# EAGLE design BaseStationV3 (EAGLE 5.07)
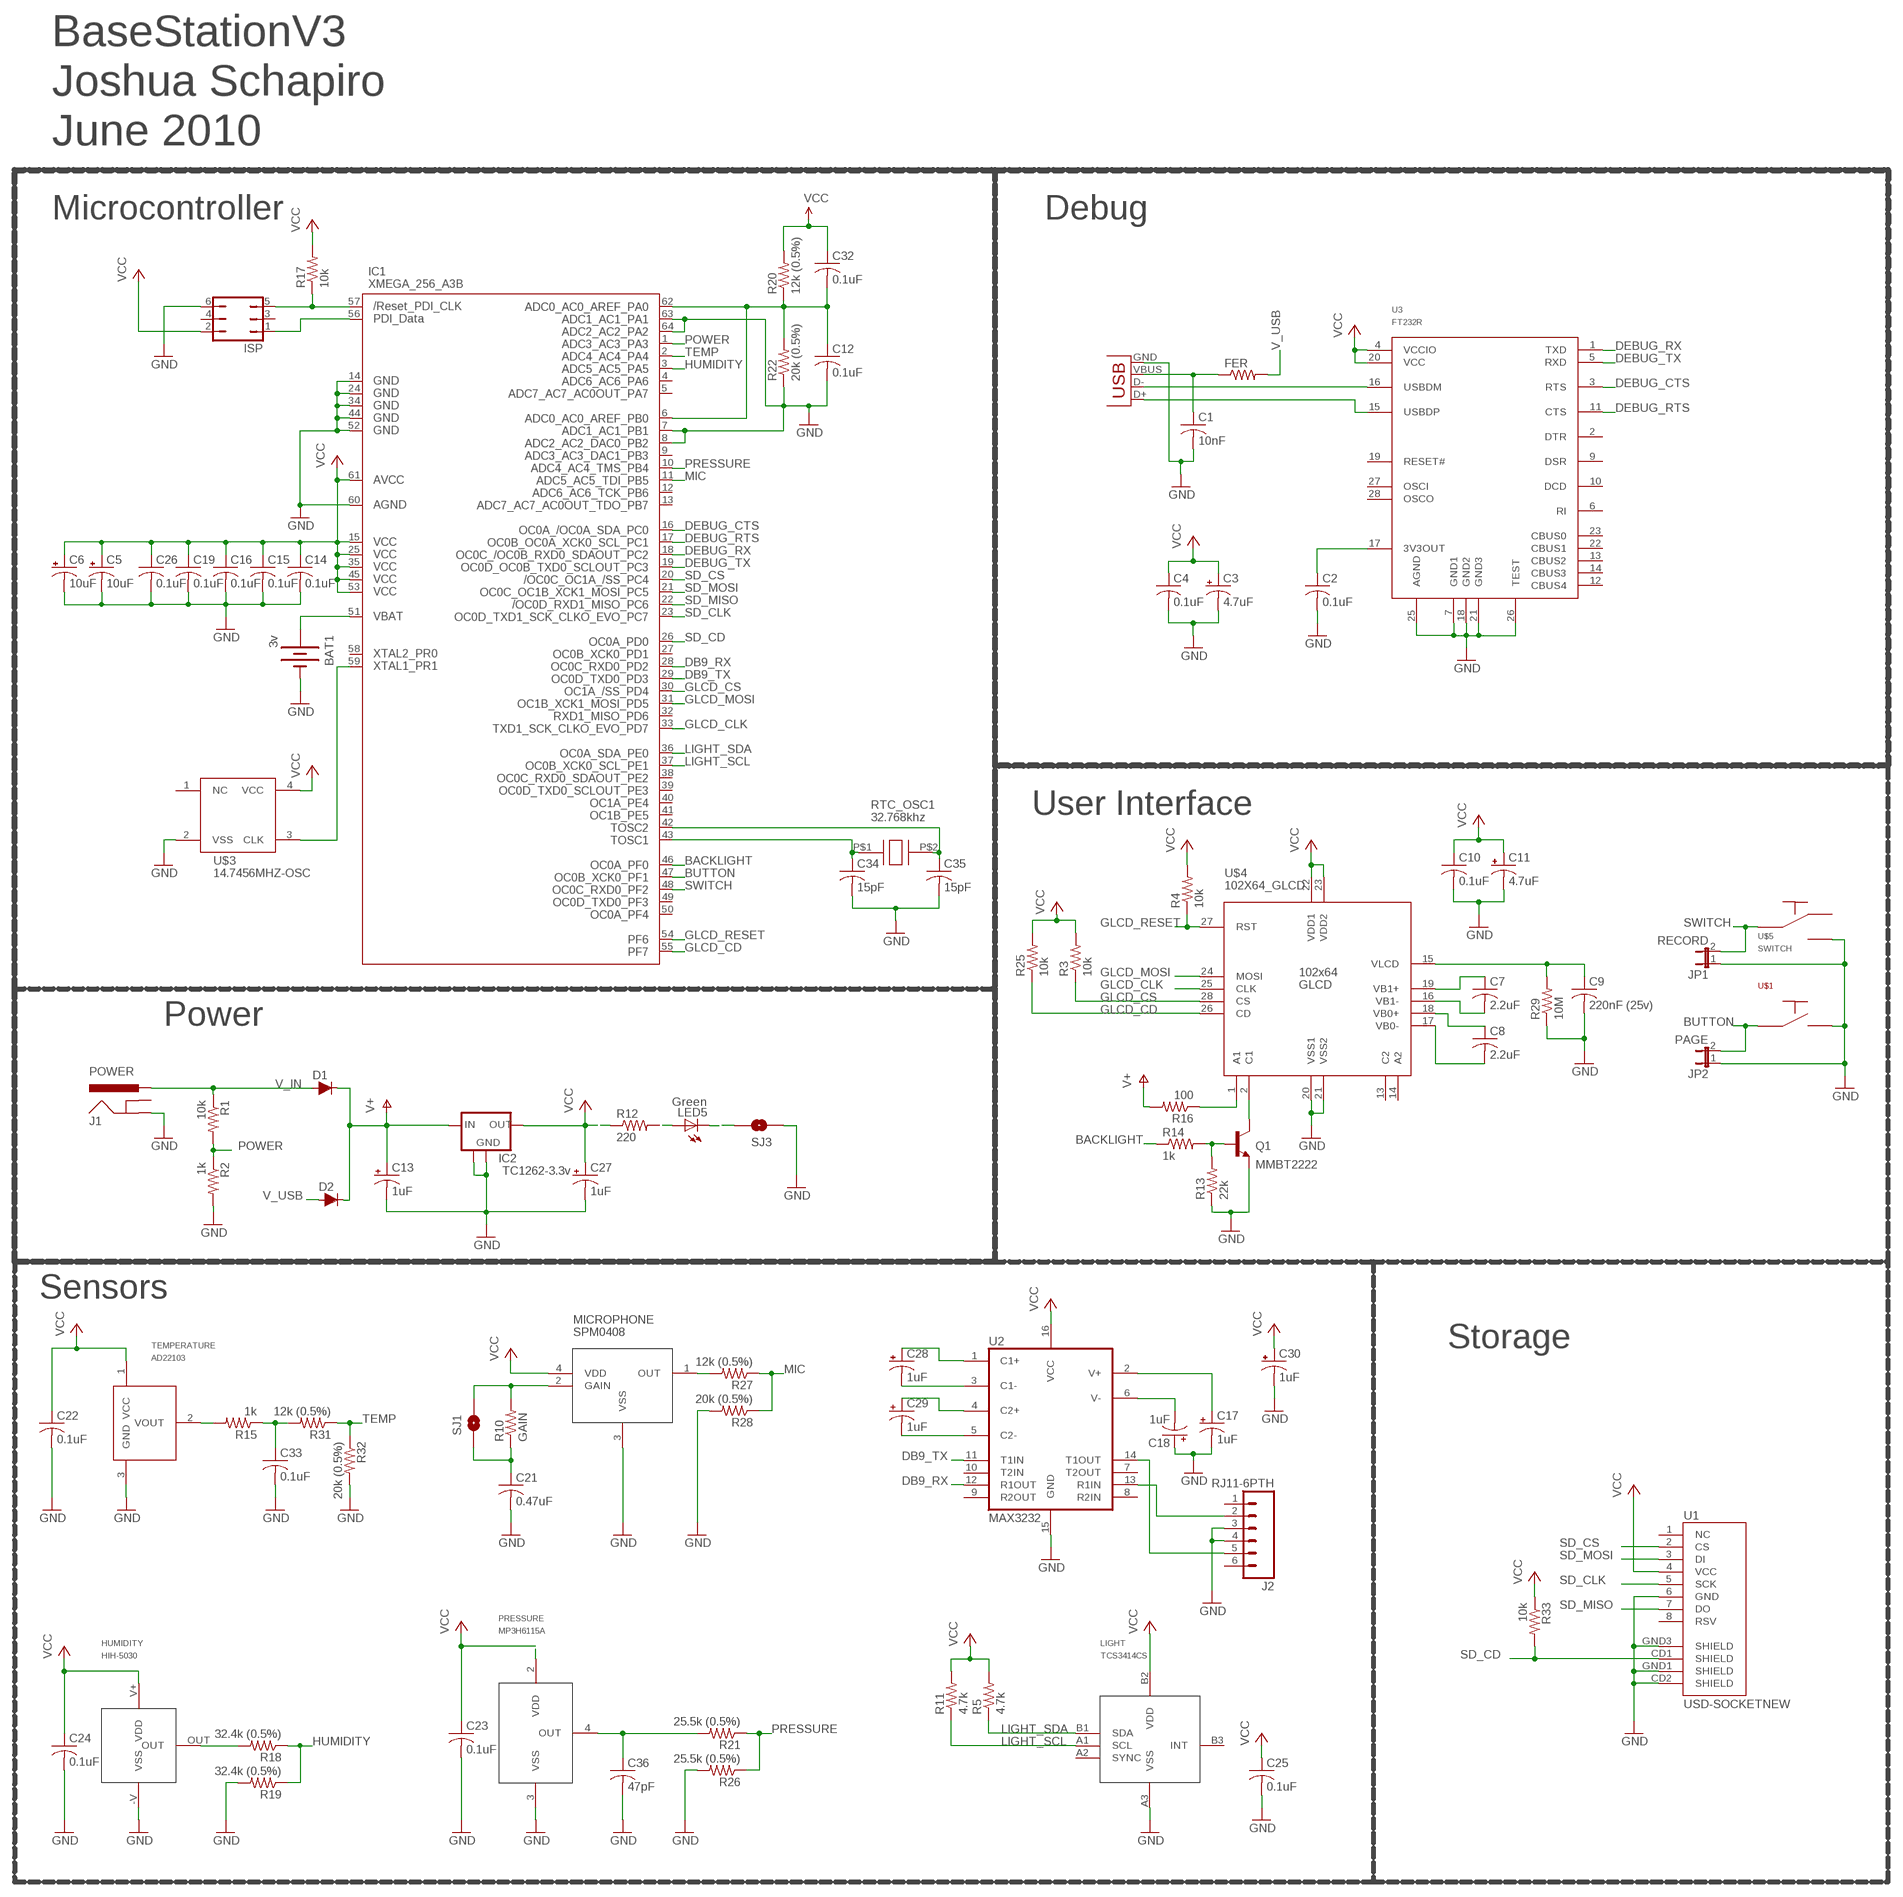
[diagram p0: schematic, sheet 1]

## Parts
BAT1  3v  BATTERY20PTH  [BATTCOM_20MM_PTH]
C1  10nF  C-USC1206  [C1206]
C2  0.1uF  C-USC1206  [C1206]
C3  4.7uF  CAP_POL1206  [EIA3216]
C4  0.1uF  C-USC1206  [C1206]
C5  10uF  CAP_POL1206  [EIA3216]
C6  10uF  CAP_POL1206  [EIA3216]
C7  2.2uF  C-USC1206  [C1206]
C8  2.2uF  C-USC1206  [C1206]
C9  220nF (25v)  C-USC1206  [C1206]
C10  0.1uF  C-USC1206  [C1206]
C11  4.7uF  CAP_POL1206  [EIA3216]
C12  0.1uF  C-USC1206  [C1206]
C13  1uF  CAP_POL1206  [EIA3216]
C14  0.1uF  C-USC1206  [C1206]
C15  0.1uF  C-USC1206  [C1206]
C16  0.1uF  C-USC1206  [C1206]
C17  1uF  CAP_POL1206  [EIA3216]
C18  1uF  CAP_POL1206  [EIA3216]
C19  0.1uF  C-USC1206  [C1206]
C21  0.47uF  C-USC1206  [C1206]
C22  0.1uF  C-USC1206  [C1206]
C23  0.1uF  C-USC1206  [C1206]
C24  0.1uF  C-USC1206  [C1206]
C25  0.1uF  C-USC1206  [C1206]
C26  0.1uF  C-USC1206  [C1206]
C27  1uF  CAP_POL1206  [EIA3216]
C28  1uF  CAP_POL1206  [EIA3216]
C29  1uF  CAP_POL1206  [EIA3216]
C30  1uF  CAP_POL1206  [EIA3216]
C32  0.1uF  C-USC1206  [C1206]
C33  0.1uF  C-USC1206  [C1206]
C34  15pF  C-USC1206  [C1206]
C35  15pF  C-USC1206  [C1206]
C36  47pF  C-USC1206  [C1206]
D1  D-FILL-SMB  [SMB]
D2  D-FILL-SMB  [SMB]
FER  R-US_R0805  [R0805]
HUMIDITY  HIH-5030  [HIH-5030]
IC1  XMEGA_256_A3B  AVR_XMEGA_A3B_64A  [TQFP64]
IC2  TC1262-3.3v  REGULATOR  [SOT223]
ISP  JP3Q  [JP3Q]
J1  POWER  POWER_JACKPTH_LOCK  [POWER_JACK_PTH_LOCK]
J2  RJ11-6PTH  [RJ11-6]
JP1  RECORD  JP1E  [JP1]
JP2  PAGE  JP1E  [JP1]
LED5  Green  LEDCHIPLED_1206  [CHIPLED_1206]
LIGHT  TCS3414CS  [2X3BGA]
MICROPHONE  SPM0408  [SPM0408]
PRESSURE  MP3H6115A  [1317-04]
Q1  MMBT2222  TRANSISTOR_NPNSOT23-3  [SOT23-3]
R1  10k  R-US_R1206  [R1206]
R2  1k  R-US_R1206  [R1206]
R3  10k  R-US_R1206  [R1206]
R4  10k  R-US_R1206  [R1206]
R5  4.7k  R-US_R1206  [R1206]
R10  GAIN  R-US_R1206  [R1206]
R11  4.7k  R-US_R1206  [R1206]
R12  220  R-US_R1206  [R1206]
R13  22k  R-US_R1206  [R1206]
R14  1k  R-US_R1206  [R1206]
R15  1k  R-US_R1206  [R1206]
R16  100  R-US_R1206  [R1206]
R17  10k  R-US_R1206  [R1206]
R18  32.4k (0.5%)  R-US_R1206  [R1206]
R19  32.4k (0.5%)  R-US_R1206  [R1206]
R20  12k (0.5%)  R-US_R1206  [R1206]
R21  25.5k (0.5%)  R-US_R1206  [R1206]
R22  20k (0.5%)  R-US_R1206  [R1206]
R25  10k  R-US_R1206  [R1206]
R26  25.5k (0.5%)  R-US_R1206  [R1206]
R27  12k (0.5%)  R-US_R1206  [R1206]
R28  20k (0.5%)  R-US_R1206  [R1206]
R29  10M  R-US_R1206  [R1206]
R31  12k (0.5%)  R-US_R1206  [R1206]
R32  20k (0.5%)  R-US_R1206  [R1206]
R33  10k  R-US_R1206  [R1206]
RTC_OSC1  32.768khz  RTC_CRYSTAL  [2-SMD]
SJ1  SOLDERJUMPERNC2  [SJ_2S-NOTRACE]
SJ3  SOLDERJUMPERNO  [SJ_2S-NO]
TEMPERATURE  AD22103  [TO-92]
U1  USD-SOCKETNEW  [MICRO-SD-SOCKET-PP]
U2  MAX3232  MAX232SOIC16  [SO016]
U3  FT232R  [SSOP28]
U$1  BUTTON  [SMDBUTTON]
U$3  14.7456MHZ-OSC  16MHZ-OSC  [4-SMD]
U$4  102X64_GLCD  [102X64_GLCD]
U$5  SWITCH  [RA_J7_SM_SWTICH]
X1  USBPTH  [USB-B-PTH]

## Nets
BACKLIGHT: IC1.46(PF0) R14.1
BUTTON: IC1.47(PF1) JP2.2 U$1.1
DB9_RX: IC1.28(PD2) U2.12(R1OUT)
DB9_TX: IC1.29(PD3) U2.11(T1IN)
DEBUG_CTS: IC1.16(PC0) U3.3(RTS)
DEBUG_RTS: IC1.17(PC1) U3.11(CTS)
DEBUG_RX: IC1.18(PC2) U3.1(TXD)
DEBUG_TX: IC1.19(PC3) U3.5(RXD)
GLCD_CD: IC1.55(PF7) R25.1 U$4.26(CD)
GLCD_CLK: IC1.33(PD7) U$4.25(CLK)
GLCD_CS: IC1.30(PD4) R3.1 U$4.28(CS)
GLCD_MOSI: IC1.31(PD5) U$4.24(MOSI)
GLCD_RESET: IC1.54(PF6) R4.1 U$4.27(RST)
GND: BAT1.2(-) C1.2 C2.2 C3.C(-) C4.2 C5.C(-) C6.C(-) C9.2 C10.2 C11.C(-) C12.2 C13.C(-) C14.2 C15.2 C16.2 C17.C(-) C18.A(+) C19.2 C21.2 C22.2 C23.2 C24.2 C25.2 C26.2 C27.C(-) C30.C(-) C33.2 C34.2 C35.2 C36.2 HUMIDITY.-V(VSS) IC1.7(PB1) IC1.8(PB2) IC1.14(GND1) IC1.24(GND2) IC1.34(GND3) IC1.44(GND4) IC1.52(GND5) IC1.60(AGND) IC1.63(PA1) IC1.64(PA2) IC2.2(GND) IC2.4(GND1) ISP.6 J1.GND J2.3 J2.4 JP1.1 JP2.1 LIGHT.A3(VSS) MICROPHONE.3(VSS) PRESSURE.3(VSS) Q1.2(E) R2.2 R13.1 R19.2 R22.1 R26.2 R28.2 R29.1 R32.2 SJ3.1 TEMPERATURE.3(GND) U1.6(GND) U1.CD2(SHIELD) U1.GND1(SHIELD) U1.GND3(SHIELD) U2.15(GND) U3.7(GND1) U3.18(GND2) U3.21(GND3) U3.25(AGND) U3.26(TEST) U$1.3 U$3.2(VSS) U$4.20(VSS1) U$4.21(VSS2) U$5.3 X1.GND
HUMIDITY: IC1.3(PA5) R18.1 R19.1
LIGHT_SCL: IC1.37(PE1) LIGHT.A1(SCL) R11.1
LIGHT_SDA: IC1.36(PE0) LIGHT.B1(SDA) R5.1
MIC: IC1.11(PB5) R27.1 R28.1
N$1: IC1.57(RESET) ISP.5 R17.1
N$2: IC1.56(PDI_DATA) ISP.1
N$3: C12.1 C32.2 IC1.6(PB0) IC1.62(PA0) R20.1 R22.2
N$4: BAT1.1(+) IC1.51(VBAT)
N$6: C18.C(-) U2.6(V-)
N$8: C17.A(+) U2.2(V+)
N$9: IC1.59(PR1) U$3.3(CLK)
N$10: C1.1 FER.1 X1.VBUS
N$12: U3.16(USBDM) X1.D-
N$13: U3.15(USBDP) X1.D+
N$14: C7.1 U$4.19(VB1+)
N$15: C7.2 U$4.16(VB1-)
N$18: C2.1 U3.17(3V3OUT)
N$19: Q1.3(C) U$4.2(C1)
N$21: C8.1 U$4.18(VB0+)
N$22: C8.2 U$4.17(VB0-)
N$23: C9.1 R29.2 U$4.15(VLCD)
N$24: C33.1 R15.1 R31.2
N$25: Q1.1(B) R13.2 R14.2
N$32: C21.1 R10.1 SJ1.1
N$33: MICROPHONE.2(GAIN) R10.2 SJ1.2
N$35: LED5.C SJ3.2
N$36: R15.2 TEMPERATURE.2(VOUT)
N$37: LED5.A R12.2
N$38: HUMIDITY.OUT R18.2
N$39: R16.1 U$4.1(A1)
N$40: C36.1 PRESSURE.4(OUT) R21.2
N$41: C28.A(+) U2.1(C1+)
N$42: C28.C(-) U2.3(C1-)
N$43: C29.A(+) U2.4(C2+)
N$47: MICROPHONE.1(OUT) R27.2
N$49: C29.C(-) U2.5(C2-)
N$50: C35.1 IC1.42(TOSC2) RTC_OSC1.P$2
N$51: C34.1 IC1.43(TOSC1) RTC_OSC1.P$1
POWER: IC1.1(PA3) R1.2 R2.1
PRESSURE: IC1.10(PB4) R21.1 R26.1
RX_: J2.2 U2.13(R1IN)
SD_CD: IC1.26(PD0) R33.2 U1.CD1(SHIELD)
SD_CLK: IC1.23(PC7) U1.5(SCK)
SD_CS: IC1.20(PC4) U1.2(CS)
SD_MISO: IC1.22(PC6) U1.7(DO)
SD_MOSI: IC1.21(PC5) U1.3(DI)
SWITCH: IC1.48(PF2) JP1.2 U$5.2
TEMP: IC1.2(PA4) R31.1 R32.1
TX_: J2.5 U2.14(T1OUT)
V+: C13.A(+) D1.1(C) D2.1(C) IC2.1(IN) R16.2
V_IN: D1.2(A) J1.PWR R1.1
V_USB: D2.2(A) FER.2
VCC: C3.A(+) C4.1 C5.A(+) C6.A(+) C10.1 C11.A(+) C14.1 C15.1 C16.1 C19.1 C22.1 C23.1 C24.1 C25.1 C26.1 C27.A(+) C30.A(+) C32.1 HUMIDITY.V+(VDD) IC1.15(VCC1) IC1.25(VCC2) IC1.35(VCC3) IC1.45(VCC4) IC1.53(VCC5) IC1.61(AVCC) IC2.3(OUT) ISP.2 LIGHT.B2(VDD) MICROPHONE.4(VDD) PRESSURE.2(VDD) R3.2 R4.2 R5.2 R11.2 R12.1 R17.2 R20.2 R25.2 R33.1 TEMPERATURE.1(VCC) U1.4(VCC) U2.16(VCC) U3.4(VCCIO) U3.20(VCC) U$3.4(VCC) U$4.22(VDD1) U$4.23(VDD2)
Unconnected: IC1.4(PA6) IC1.5(PA7) IC1.9(PB3) IC1.12(PB6) IC1.13(PB7) IC1.27(PD1) IC1.32(PD6) IC1.38(PE2) IC1.39(PE3) IC1.40(PE4) IC1.41(PE5) IC1.49(PF3) IC1.50(PF4) IC1.58(PR0) ISP.3 ISP.4 J1.GNDBREAK J2.1 J2.6 LIGHT.A2(SYNC) LIGHT.B3(INT) U1.1(NC) U1.8(RSV) U2.7(T2OUT) U2.8(R2IN) U2.9(R2OUT) U2.10(T2IN) U3.2(DTR) U3.6(RI) U3.9(DSR) U3.10(DCD) U3.12(CBUS4) U3.13(CBUS2) U3.14(CBUS3) U3.19(RESET#) U3.22(CBUS1) U3.23(CBUS0) U3.27(OSCI) U3.28(OSCO) U$3.1(NC) U$4.13(C2) U$4.14(A2) U$5.1

## Notes on the sheet
- BaseStationV3
- Joshua Schapiro
- June 2010
- Microcontroller | Debug
- User Interface
- Power
- Sensors
- Storage

## Library data of the parts
BAT1 = SparkFun:BATTERY: Battery Holders Various common sizes : AA, AAA, 20mm coin cell and 12mm coin cell.
C1 C2 C4 C7-C10 C12 C14-C16 C19 C21-C26 C32-C36 = resistor:C-US: CAPACITOR, American symbol
C3 C5 C6 C11 C13 C17 C18 C27-C30 = SparkFun:CAP_POL: Capacitor Polarized These are standard SMD and PTH capacitors. Normally 10uF, 47uF, and 100uF in electrolytic and tantalum varieties. Always verify the external diameter of the through hole cap, it varies with capacity, voltage, and manufacturer. The EIA devices should be standard.
D1 D2 = semicon-smd-ipc:D-FILL-: DIODE filled
FER R1-R5 R10-R22 R25-R29 R31-R33 = resistor:R-US_: RESISTOR, American symbol
HUMIDITY = Josh:HIH-5030
IC1 = xmega:AVR_XMEGA_A3B_: Device for Atmel AVR XMEGA A3B Series
IC2 = GadgetOne:REGULATOR: VOLTAGE REGULATOR, see: http://focus.ti.com/lit/ds/symlink/ua78m05.pdf
ISP = jumper:JP3Q: JUMPER
J1 = SparkFun:POWER_JACK: Power Jack This is the standard 5.5mm barrel jack for power. The PTH is the most common, proven, reliable, footprint. All others are experimental. The Slot footprint only works if the mill layer is transmitted to the PCB fab house so be warned. Spark Fun Electronics SKU : PRT-00119. Mating wall wart : TOL-00298 (and others)
J2 = SparkFun:RJ11-6: RJ11 Jack Simple 6 pin RJ11 jack. Commonly found on CAT3 devices and Microchip programmers. SKU: PRT-00132
JP1 JP2 = jumper:JP1E: JUMPER
LED5 = led:LED: LED OSRAM: - CHIPLED LG R971, LG N971, LY N971, LG Q971, LY Q971, LO R971, LY R971 LH N974, LH R974 LS Q976, LO Q976, LY Q976 LO Q996 - Hyper CHIPLED LW Q18S LB Q993, LB Q99A, LB R99A - SideLED LS A670, LO A670, LY A670, LG A670, LP A670 LB A673, LV A673, LT A673, LW A673 LH A674 LY A675 LS A676, LA A676, LO A676, LY A676, LW A676 LS A679, LY A679, LG A679 - Hyper Micro SIDELED® LS Y876, LA Y876, LO Y876, LY Y876 LT Y87S - SmartLED LW L88C, LW L88S LB L89C, LB L89S, LG L890 LS L89K, LO L89K, LY L89K LS L896, LA L896, LO L896, LY L896 - TOPLED LS T670, LO T670, LY T670, LG T670, LP T670 LSG T670, LSP T670, LSY T670, LOP T670, LYG T670 LG T671, LOG T671, LSG T671 LB T673, LV T673, LT T673, LW T673 LH T674 LS T676, LA T676, LO T676, LY T676, LB T676, LH T676, LSB T676, LW T676 LB T67C, LV T67C, LT T67C, LS T67K, LO T67K, LY T67K, LW E67C LS E67B, LA E67B, LO E67B, LY E67B, LB E67C, LV E67C, LT E67C LW T67C LS T679, LY T679, LG T679 LS T770, LO T770, LY T770, LG T770, LP T770 LB T773, LV T773, LT T773, LW T773 LH T774 LS E675, LA E675, LY E675, LS T675 LS T776, LA T776, LO T776, LY T776, LB T776 LHGB T686 LT T68C, LB T68C - Hyper Mini TOPLED® LB M676 - Mini TOPLED Santana® LG M470 LS M47K, LO M47K, LY M47K Source: http://www.osram.convergy.de - LUMILED® LXK2-PW12-R00, LXK2-PW12-S00, LXK2-PW14-U00, LXK2-PW14-V00 LXK2-PM12-R00, LXK2-PM12-S00, LXK2-PM14-U00 LXK2-PE12-Q00, LXK2-PE12-R00, LXK2-PE12-S00, LXK2-PE14-T00, LXK2-PE14-U00 LXK2-PB12-K00, LXK2-PB12-L00, LXK2-PB12-M00, LXK2-PB14-N00, LXK2-PB14-P00, LXK2-PB14-Q00 LXK2-PR12-L00, LXK2-PR12-M00, LXK2-PR14-Q00, LXK2-PR14-R00 LXK2-PD12-Q00, LXK2-PD12-R00, LXK2-PD12-S00 LXK2-PH12-R00, LXK2-PH12-S00 LXK2-PL12-P00, LXK2-PL12-Q00, LXK2-PL12-R00 Source: www.luxeon.com
LIGHT = Josh:TCS3414CS
MICROPHONE = Josh:SPM0408
PRESSURE = Josh:MP3H6115A
Q1 = SparkFun:TRANSISTOR_NPN: Transistor NPN BJT configuration in SOT23 package. MMBT2222 is the common NPN we use. Double check BCE configuration again layout.
RTC_OSC1 = Josh:RTC_CRYSTAL
SJ1 SJ3 = SparkFun:SOLDERJUMPER: Solder Jumper Standard SMD solder jumper. Used to automate production. Two varients : Normally Open and Normally Closed are the same, but have different paste layers. NC will have a large amount of paste and should jumper during reflow.
TEMPERATURE = Josh:AD22103
U1 = SparkFun:USD-SOCKET: microSD Socket Push-push type uSD socket. Schematic element and footprint production proven. Spark Fun Electronics SKU : PRT-00127. tDoc lines correctly indicate media card edge positions when inserting (unlocked, locked, depressed).
U2 = SparkFun:MAX232: RS232 Transceiver Very common IC. This is generically called 'MAX232', but works with the 3V equivalent MAX3232 generic ICs. Field tested and mother approved. Spark Fun Electronics SKU : COM-00316 (DIP) and COM-00589 (SMD)
U3 = gadgetry:FT232R
U$1 = GadgetOne:BUTTON
U$3 = Josh:16MHZ-OSC
U$4 = Josh:102X64_GLCD
U$5 = GadgetOne:SWITCH: Part number JS102011SAQN
X1 = SparkFun:USB: USB Connectors USB-B-PTH is fully proven SKU : PRT-00139 USB-miniB is fully proven SKU : PRT-00587 USB-A-PCB is untested. USB-A-H is throughly reviewed, but untested. Spark Fun Electronics SKU : PRT-00437 USB-B-SMT is throughly reviewed, but untested. Needs silkscreen touching up. USB-A-S has not been used/tested USB-MB-H has not been used/tested

## Board
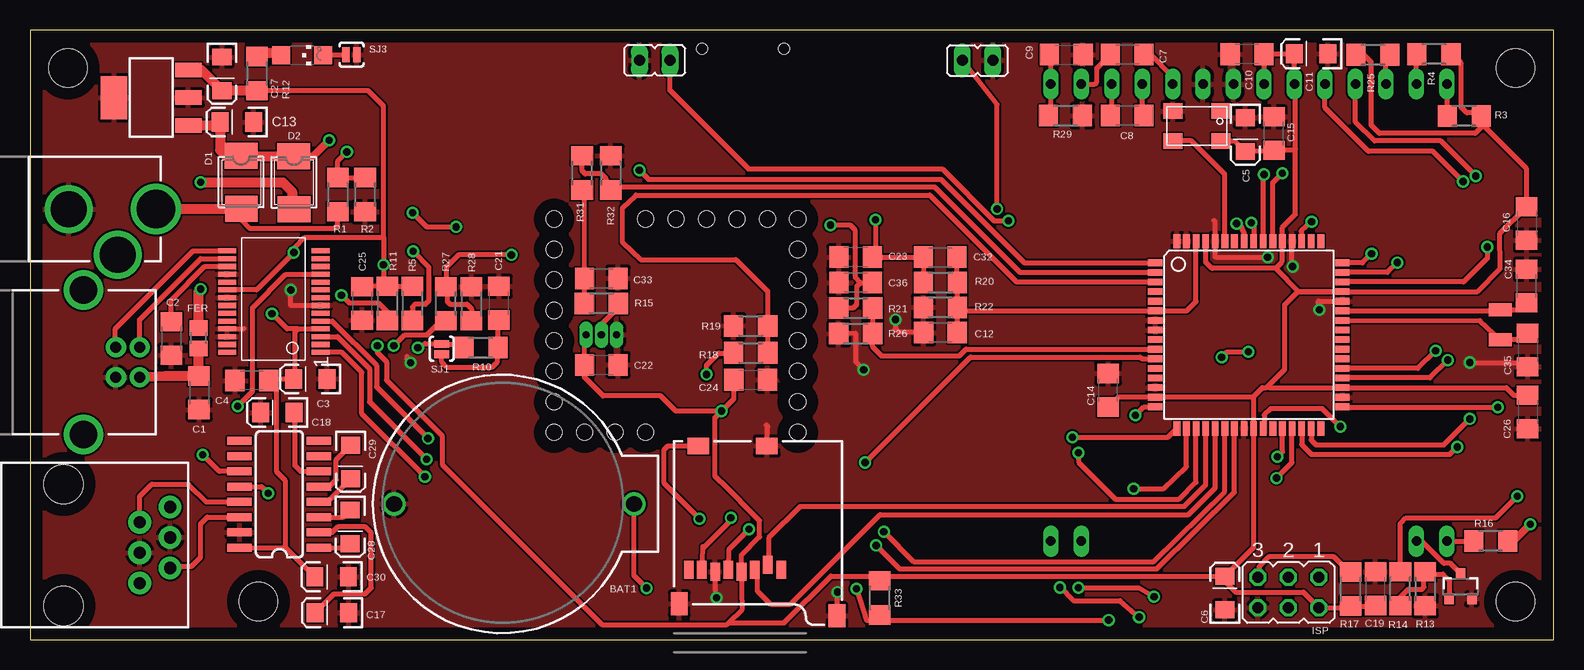
[diagram p1: board, top side]
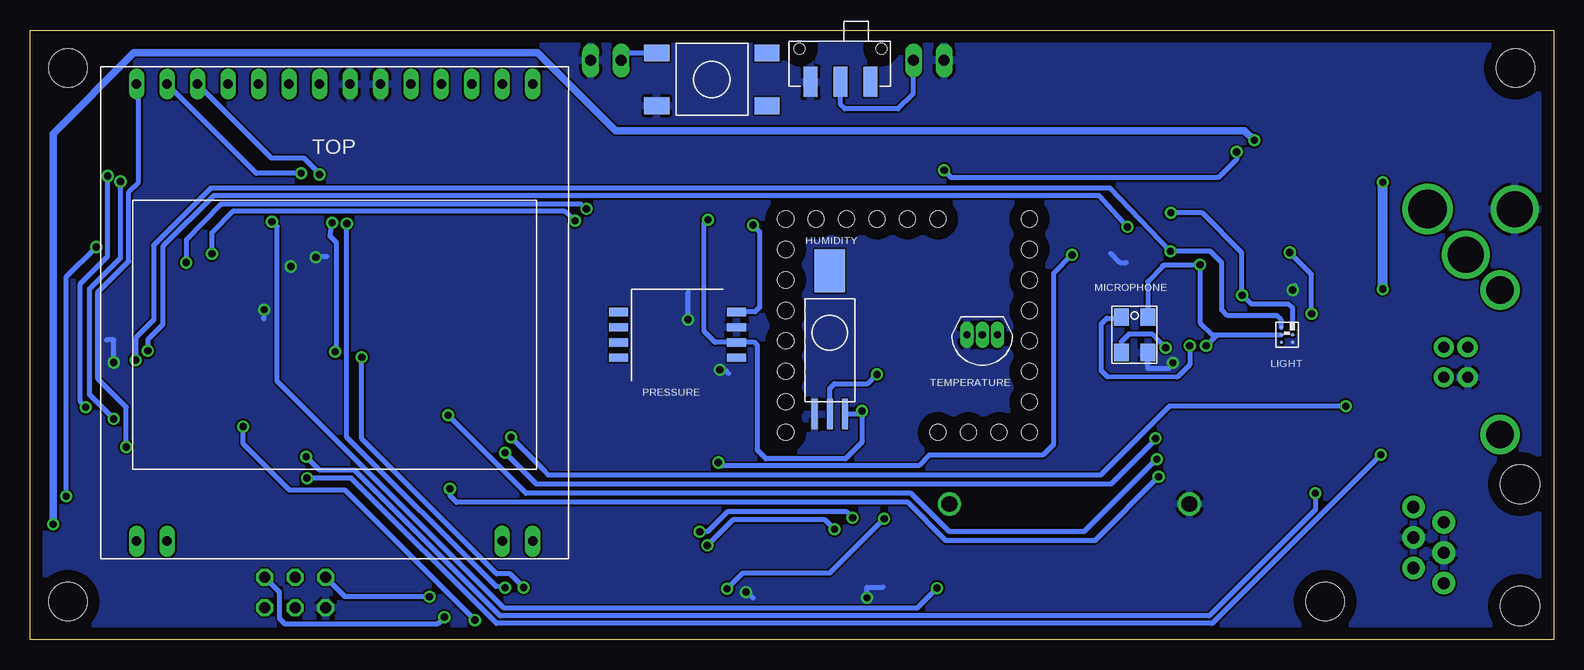
[diagram p2: board, bottom side, seen from below]

Size 127 x 50.8 mm. Coordinates in mm from the lower left corner, seen from the top.
Outline: 0,0 127,0 127,50.8 0,50.8 0,0
Copper layers (1*16): Top 0.035mm / dielectric 1.5mm / Bottom 0.035mm
Design rules "default *": minimum track width 6mil, minimum drill 15mil, track to track 6mil, track to pad 6mil, pad to pad 6mil, via to via 6mil, smd to smd 6mil, copper to edge 40mil, drill to drill 8mil, minimum pad ring 10mil, minimum via ring 8mil, stop-mask expansion 4mil, vias tented up to drill 0mil, thermal gap 10mil
Holes 3.2 mm at 19.05,3.17 123.83,47.62 123.83,3.17 3.17,47.62
Holes 1.33 mm at 64.01,35.05 61.47,35.05 58.93,35.05 56.39,35.05 53.85,35.05 51.31,35.05 64.01,32.51 64.01,29.97 64.01,27.43 64.01,22.35 64.01,24.89 43.69,35.05 43.69,32.51 43.69,29.97 43.69,27.43 43.69,24.89 43.69,22.35 43.69,19.81 64.01,19.81 43.69,17.27 46.23,17.27 48.77,17.27 51.31,17.27 64.01,17.27

### Footprints (pad centres in the part's own frame; a part is rotated, then mirrored left to right if it is on the bottom)
BATTCOM_20MM_PTH = drill 1.3 round: 1 20,0; 2 0,0
C1206 = smd 1.6 x 1.8: 1 -1.4,0; 2 1.4,0
EIA3216 = smd 1.4 x 1.6: A 1.4,0; C -1.4,0
SMB = smd 2.159 x 2.743: 1 -2.311,-0.127; 2 2.108,-0.102
R0805 = smd 1.3 x 1.5: 1 -0.85,0; 2 0.85,0
HIH-5030 = smd 0.508 x 2.54: -V -1.27,-5.334; OUT 0,-5.334; V+ 1.27,-5.334 | smd 2.54 x 3.556: NC 0,6.604
TQFP64 = smd 1.194 x 0.559: 1 -7.8,6; 2 -7.8,5.2; 3 -7.8,4.4; 4 -7.8,3.6; 5 -7.8,2.8; 6 -7.8,2; 7 -7.8,1.2; 8 -7.8,0.4; 9 -7.8,-0.4; 10 -7.8,-1.2; 11 -7.8,-2; 12 -7.8,-2.8; 13 -7.8,-3.6; 14 -7.8,-4.4; 15 -7.8,-5.2; 16 -7.8,-6; 33 7.8,-6; 34 7.8,-5.2; 35 7.8,-4.4; 36 7.8,-3.6; 37 7.8,-2.8; 38 7.8,-2; 39 7.8,-1.2; 40 7.8,-0.4; 41 7.8,0.4; 42 7.8,1.2; 43 7.8,2; 44 7.8,2.8; 45 7.8,3.6; 46 7.8,4.4; 47 7.8,5.2; 48 7.8,6 | smd 0.559 x 1.194: 17 -6,-7.8; 18 -5.2,-7.8; 19 -4.4,-7.8; 20 -3.6,-7.8; 21 -2.8,-7.8; 22 -2,-7.8; 23 -1.2,-7.8; 24 -0.4,-7.8; 25 0.4,-7.8; 26 1.2,-7.8; 27 2,-7.8; 28 2.8,-7.8; 29 3.6,-7.8; 30 4.4,-7.8; 31 5.2,-7.8; 32 6,-7.8; 49 6,7.8; 50 5.2,7.8; 51 4.4,7.8; 52 3.6,7.8; 53 2.8,7.8; 54 2,7.8; 55 1.2,7.8; 56 0.4,7.8; 57 -0.4,7.8; 58 -1.2,7.8; 59 -2,7.8; 60 -2.8,7.8; 61 -3.6,7.8; 62 -4.4,7.8; 63 -5.2,7.8; 64 -6,7.8
SOT223 = smd 1.219 x 2.235: 1 -2.311,-3.099; 2 0,-3.099; 3 2.311,-3.099 | smd 3.6 x 2.2: 4 0,3.099
JP3Q = drill 0.914 octagon: 1 -2.54,-1.27; 2 -2.54,1.27; 3 0,-1.27; 4 0,1.27; 5 2.54,-1.27; 6 2.54,1.27
POWER_JACK_PTH_LOCK = drill 2.997 round: GND 0.025,6.608; GNDBREAK 3.812,10.7 | drill 3.2 round: PWR 0,13.878
RJ11-6 = drill 1.016 pad 1.88 round: 1 1.905,8.89; 2 3.175,6.35; 3 4.445,8.89; 4 5.715,6.35; 5 6.985,8.89; 6 8.255,6.35 | hole 3.251: 0,0; 10.16,0
JP1 = drill 0.914 long: 1 0,-1.27; 2 0,1.27
CHIPLED_1206 = smd 1.5 x 1.5: A 0,-1.75; C 0,1.75
2X3BGA = smd 0.3 x 0.3: A1 -0.61,0.475; A2 0,0.475; A3 0.61,0.475; B1 -0.61,-0.475; B2 0,-0.475; B3 0.61,-0.475
SPM0408 = smd 1.245 x 1.448: 1 -1.105,1.486; 2 -1.105,-1.486; 3 1.105,-1.486; 4 1.105,1.486
1317-04 = smd 1.6 x 0.686: 1 -4.915,1.905; 2 -4.915,0.635; 3 -4.915,-0.635; 4 -4.915,-1.905; 5 4.915,-1.905; 6 4.915,-0.635; 7 4.915,0.635; 8 4.915,1.905
SOT23-3 = smd 0.8 x 0.9: 1 -0.95,-1; 2 0.95,-1; 3 0,1.1
R1206 = smd 1.6 x 1.803: 1 -1.422,0; 2 1.422,0
2-SMD = smd 1.092 x 1.905: P$1 -1.245,0; P$2 1.245,0
SJ_2S-NOTRACE = smd 0.635 x 1.27: 1 -0.45,0; 2 0.4,0
SJ_2S-NO = smd 0.635 x 1.27: 1 -0.45,0; 2 0.45,0
TO-92 = drill 0.6 long: 1 -1.27,0; 2 0,0; 3 1.27,0
MICRO-SD-SOCKET-PP = smd 0.8 x 1.5: 1 -8.94,10.7; 2 -7.84,10.3; 3 -6.74,10.7; 4 -5.64,10.9; 5 -4.54,10.7; 6 -3.44,10.9; 7 -2.34,10.7; 8 -1.24,10.7 | smd 1.8 x 1.4: CD1 -2.05,0.4; CD2 -7.75,0.4 | smd 1.4 x 1.9: GND1 -13.6,14.55; GND3 -0.45,13.55
SO016 = smd 0.66 x 2.032: 1 -4.445,-3.315; 2 -3.175,-3.315; 3 -1.905,-3.315; 4 -0.635,-3.315; 5 0.635,-3.315; 6 1.905,-3.315; 7 3.175,-3.315; 8 4.445,-3.315; 9 4.445,3.315; 10 3.175,3.315; 11 1.905,3.315; 12 0.635,3.315; 13 -0.635,3.315; 14 -1.905,3.315; 15 -3.175,3.315; 16 -4.445,3.315
SSOP28 = smd 0.425 x 1.5: 1 0.65,-1.3; 2 1.3,-1.3; 3 1.95,-1.3; 4 2.6,-1.3; 5 3.25,-1.3; 6 3.9,-1.3; 7 4.55,-1.3; 8 5.2,-1.3; 9 5.85,-1.3; 10 6.5,-1.3; 11 7.15,-1.3; 12 7.8,-1.3; 13 8.45,-1.3; 14 9.1,-1.3; 15 9.1,6.5; 16 8.45,6.5; 17 7.8,6.5; 18 7.15,6.5; 19 6.5,6.5; 20 5.85,6.5; 21 5.2,6.5; 22 4.55,6.5; 23 3.9,6.5; 24 3.25,6.5; 25 2.6,6.5; 26 1.95,6.5; 27 1.3,6.5; 28 0.65,6.5
SMDBUTTON = smd 2.1 x 1.4: 1 -1.6,5.2; 2 7.6,5.2; 3 -1.6,0.8; 4 7.6,0.8
4-SMD = smd 1.6 x 1.3: 1 -2,-1.25; 2 2,-1.25; 3 2,1.25; 4 -2,1.25
102X64_GLCD = drill 0.8 long: 1 -16.51,-17.2; 2 -13.97,-17.2; 13 13.97,-17.2; 14 16.51,-17.2; 15 16.51,20.9; 16 13.97,20.9; 17 11.43,20.9; 18 8.89,20.9; 19 6.35,20.9; 20 3.81,20.9; 21 1.27,20.9; 22 -1.27,20.9; 23 -3.81,20.9; 24 -6.35,20.9; 25 -8.89,20.9; 26 -11.43,20.9; 27 -13.97,20.9; 28 -16.51,20.9
RA_J7_SM_SWTICH = smd 1.2 x 2.5: 1 -2.5,0; 2 0,0; 3 2.5,0 | hole 0.9: 3.4,-2.75; -3.4,-2.75
USB-B-PTH = drill 0.914 pad 1.676 round: D+ 0,1.25; D- 1.981,1.25; GND 0,-1.25; VBUS 1.981,-1.25 | drill 2.286 round: P$1 -2.718,-6.02; P$2 -2.718,6.02

### Placement (x,y rotation side)
BAT1  30.35,11.3 0 top
C1  14.1,20.57 270 top
C2  11.79,25.1 270 top
C3  23.37,21.72 180 top
C4  18.49,21.59 180 top
C5  101.32,42.08 270 top
C6  99.61,3.89 90 top
C7  91.47,48.74 180 top
C8  91.47,43.66 180 top
C9  86.39,48.74 0 top
C10  101.45,48.78 180 top
C11  106.79,48.83 180 top
C12  75.9,25.58 180 top
C13  17.25,43.13 180 top
C14  89.88,20.78 90 top
C15  103.7,42.17 90 top
C16  124.76,34.67 270 top
C17  25.17,2.24 180 top
C18  20.62,18.92 180 top
C19  112.17,4.25 90 top
C21  39.09,28.04 90 top
C22  47.62,22.9 0 top
C23  68.83,31.88 180 top
C24  60.07,21.65 0 top
C25  27.69,28.02 270 top
C26  124.84,18.96 270 top
C27  16,47.14 270 top
C28  26.7,9.4 270 top
C29  26.72,14.81 270 top
C30  25.15,5.23 180 top
C32  75.87,31.88 0 top
C33  47.62,30.1 0 top
C34  124.76,29.46 90 top
C35  124.84,24.13 270 top
C36  68.83,29.74 180 top
D1  17.73,38 270 top
D2  22.12,37.97 270 top
FER  14.07,25.12 90 top
HUMIDITY  60.33,24.13 0 bottom
IC1  101.6,25.4 0 top
IC2  10.11,45.16 90 top
ISP  104.9,3.94 180 top
J1  -3.38,35.89 270 top
J2  2.79,12.95 270 top
JP1  52.07,48.26 270 top
JP2  78.99,48.26 90 top
LED5  22.68,48.69 270 top
LIGHT  22.23,25.4 270 bottom
MICROPHONE  34.92,25.4 0 bottom
PRESSURE  73.03,25.4 180 bottom
Q1  119.25,4.39 0 top
R1  25.65,37.08 90 top
R2  27.94,37.08 270 top
R3  119.56,43.64 0 top
R4  117.03,48.78 0 top
R5  31.88,28.02 90 top
R10  37.59,24.33 180 top
R11  29.79,28.02 90 top
R12  18.92,47.17 90 top
R13  116.31,4.24 90 top
R14  114.22,4.24 270 top
R15  47.62,28.02 0 top
R16  121.77,8.23 0 top
R17  110.08,4.22 270 top
R18  60.07,23.9 180 top
R19  60.07,26.14 180 top
R20  75.9,29.77 180 top
R21  68.83,27.64 180 top
R22  75.9,27.69 0 top
R25  111.94,48.74 180 top
R26  68.83,25.5 180 top
R27  34.67,27.99 270 top
R28  36.8,27.99 90 top
R29  86.31,43.66 180 top
R31  46.02,38.89 270 top
R32  48.41,38.89 90 top
R33  70.84,3.48 270 top
RTC_OSC1  122.56,26.24 270 top
SJ1  34.32,24.23 90 top
SJ3  26.8,48.74 180 top
TEMPERATURE  47.62,25.4 180 bottom
U1  53.67,16.54 180 top
U2  20.78,12.12 90 top
U3  22.94,23.29 90 top
U$1  73.15,43.69 0 bottom
U$3  97.28,42.8 180 top
U$4  101.6,25.4 0 bottom
U$5  59.44,46.48 180 bottom
X1  7.16,23.11 0 top

### Tracks (layer width: path | path; a pad name or v marks a point on that pad's centre or on a via)
BACKLIGHT  (via drill 0.6)
  Top 0.406: R14.1 114.22,9.65 114.71,10.13 122.17,10.13 v123.98,11.94 | v121.49,32.72 121.49,31.77 119.51,29.8 IC1.46
  Bottom 0.406: v123.98,11.94 123.98,30.23 v121.49,32.72
BUTTON  (via drill 0.6)
  Top 0.406: IC1.47 113.15,30.6 v113.97,31.42 | v80.62,35.89 80.62,44.6 JP2.2
  Bottom 0.406: U$1.1 77.1,48.89 JP2.2 | v113.97,31.42 113.97,33.33 111.1,36.3 81.1,36.3 v80.62,35.89
DB9_RX  (via drill 0.6)
  Top 0.406: U2.12 19.3,12.75 v19.86,12.19 | v103.99,15.24 104.4,15.65 IC1.28
  Bottom 0.406: v19.86,12.19 19.86,10.82 28.7,1.98 87.81,1.98 99.95,14.12 102.87,14.12 v103.99,15.24
DB9_TX  (via drill 0.6)
  Top 0.406: IC1.29 105.2,14.75 v103.91,13.46 | v14.4,15.39 15.77,14.02 U2.11
  Bottom 0.406: v103.91,13.46 100.23,13.46 88.11,1.35 28.45,1.35 v14.4,15.39
DEBUG_CTS  (via drill 0.6)
  Top 0.406: U3.3 25.63,25.24 28.3,22.58 28.3,19.81 v33.07,15.04 | v92.15,18.69 92.86,19.4 IC1.16
  Bottom 0.406: v33.07,15.04 33.1,15.04 39.14,8.99 50.37,8.99 53.57,12.19 85.65,12.19 v92.15,18.69
DEBUG_RTS  (via drill 0.6)
  Top 0.406: U3.11 21.32,30.44 18.54,27.66 18.54,20.68 v17.32,19.46 | v86.89,16.87 94.87,16.87 IC1.17
  Bottom 0.406: v17.32,19.46 32.03,19.46 37.77,13.72 54.61,13.72 56.19,13.72 83.82,13.72 84.07,14.05 v86.89,16.87
DEBUG_RX  (via drill 0.6)
  Top 0.406: U3.1 26,23.94 27.66,22.28 27.66,18.82 v32.92,13.56 | v92,12.57 94.49,12.57 96.4,14.41 IC1.18
  Bottom 0.406: v92,12.57 92,11.99 91.44,11.43 53.82,11.43 50.65,8.26 38.23,8.26 v32.92,13.56
DEBUG_TX  (via drill 0.6)
  Top 0.406: U3.5 25.2,26.54 28.88,22.86 28.88,21.06 v33.17,16.76 | v87.4,15.57 87.4,14.78 90.47,11.71 95.81,11.71 97.2,13.1 IC1.19
  Bottom 0.406: v33.17,16.76 33.17,16.66 36.88,12.95 84.78,12.95 v87.4,15.57
GLCD_CD  (via drill 0.6)
  Top 0.406: U$4.26 113.03,48.41 R25.1 | IC1.55 102.8,38.69 v102.87,38.76
  Bottom 0.406: v102.87,38.76 102.87,38.84 104.17,40.13 106.86,40.13 U$4.26
GLCD_CLK  (via drill 0.6)
  Top 0.406: U$4.25 110.49,43.13 112.06,41.55 117.6,41.55 v120.52,38.63 | v122.35,19.36 109.44,19.36 IC1.33
  Bottom 0.406: v120.52,38.63 120.52,31.93 122.81,29.64 122.81,19.81 v122.35,19.36
GLCD_CS  (via drill 0.6)
  Top 0.406: U$4.28 118.11,43.66 R3.1 | IC1.30 106,16.25 106.81,15.44 118.36,15.44 v118.97,16.05
  Bottom 0.406: v118.97,16.05 118.97,19.38 121.34,21.74 121.34,28.96 118.77,31.52 118.77,37.31 117.96,38.12 117.96,46.15 U$4.28
GLCD_MOSI  (via drill 0.6)
  Top 0.406: U$4.24 107.95,44.32 111.58,40.69 116.94,40.69 v119.46,38.18 | IC1.31 106.8,16.62 107.19,16.23 117.86,16.23 v120.02,18.39
  Bottom 0.406: v119.46,38.18 119.46,31.8 122.02,29.23 122.02,20.4 v120.02,18.39
GLCD_RESET  (via drill 0.6)
  Top 0.406: U$4.27 115.57,48.74 R4.1 | IC1.54 103.6,38.07 v104.39,38.86
  Bottom 0.406: v104.39,38.86 108.13,38.86 U$4.27
GND  (via drill 0.6)
  Top 0.406: U3.25 17.76,25.89 17.83,25.91 | IC1.44 107.4,28.2 v107.47,27.48 | U1.CD2 61.5,17.78 61.39,17.88 | U1.6 57.19,3.48 v57.23,3.48 | IC1.52 105.2,31.09 v105.26,31.09 | 98.65,34.92 arc-90 98.8,34.78 IC1.60 98.8,31.9 98.91,31.9 98.91,31.85 v103.17,31.85 | C35.2 124.84,23.09 v120.02,23.09 | U1.GND1 67.27,1.91 67.16,1.91 67.31,2.06 v67.31,3.96 | R28.2 36.91,29.51 | v31.73,23.06 31.42,23.37 31.42,23.57 | U3.7 24.21,27.86 21.69,27.86 21.74,27.91 v21.74,29.13 | C12.2 74.42,25.65 72.39,25.65 72.14,25.91 v72.14,26.67 | R26.2 68.83,25.53 68.83,23.14 v69.49,22.48
  Bottom 0.406: v107.47,27.48 107.52,26.72 107.39,27.38 | v57.23,3.48 57.23,4.37 55.88,4.37 | v105.26,31.09 105.26,31.32 | v103.17,31.85 103.17,31.93 102.23,31.93 | v120.02,23.09 120.02,24.97 120.62,24.97 | v67.31,3.96 67.31,4.01 66.73,3.48 | 36.91,32.18 36.14,31.42 35.61,31.42 | MICROPHONE.3 33.83,23.9 33.83,22.63 33.78,22.58 32.11,22.58 31.73,22.96 v31.73,23.06 | v21.74,29.13 21.54,29.34 21.54,29.49 | v72.14,26.67 72.14,28.96 | v69.49,22.48 69.06,22.48 68.76,22.17
  pour Bottom: 0,50.8 127,50.8 127,0 0,0
  pour Top: 0,0 127,0 127,50.8 0,50.8
HUMIDITY
  Top 0.406: R19.1 R18.1 | IC1.3 82.24,29.8 75.01,37.03 50.52,37.03 49.4,35.99 49.4,33.07 50.88,31.67 58.85,31.67 61.49,29.03 R19.1 | R19.1
LIGHT_SCL  (via drill 0.6)
  Top 0.406: R11.1 29.84,26.64 29.84,27.25 29.03,28.07 26.59,28.07 v25.96,28.7 | IC1.37 115.69,22.6 v117.17,24.08 | v35.51,34.39 33.07,34.39 v31.9,35.56
  Bottom 0.406: LIGHT.A1 21.75,27.62 22.1,27.96 25.17,27.96 v25.96,28.7 25.98,28.73 25.98,32.26 29.29,35.56 v31.9,35.56 | v35.51,34.39 37.87,37.01 111.68,37.01 115.93,32.77 115.93,26.24 117.17,24.99 v117.17,24.08
LIGHT_SDA  (via drill 0.6)
  Top 0.406: R5.1 31.88,27.74 32.08,27.94 32.94,27.94 33.25,28.25 33.25,31.04 v31.93,32.36 | IC1.36 116.69,21.8 v118.19,23.29
  Bottom 0.406: LIGHT.B1 22.7,26.64 23.06,27 27.18,27 27.66,27.48 27.66,31.42 28.6,32.36 v31.93,32.36 36.96,37.62 111.94,37.62 116.69,32.87 116.69,26.64 118.19,25.15 v118.19,23.29
MIC  (via drill 0.6)
  Top 0.406: 36.78,26.54 R28.1 36.8,27.58 36.42,27.96 35,27.96 34.77,28.19 34.77,29.31 R27.1 34.7,29.44 34.7,31.04 35.71,32.05 v40.13,32.05 | IC1.11 92.7,23.4 92.56,23.55 78.41,23.55 v69.62,14.76
  Bottom 0.406: v69.62,14.76 69.32,14.45 69.27,14.5 52.91,14.5 52.05,15.37 42.57,15.37 41.66,16.28 41.66,30.53 v40.13,32.05
N$1  (via drill 0.6)
  Top 0.406: R17.1 109.96,5.64 108.66,6.93 103.33,6.93 102.46,6.07 102.46,5.31 ISP.5 | IC1.57 101.2,33.85 100.86,34.62 100.64,34.62 v100.58,34.67 | v87.4,4.32 92.46,4.32 v93.7,3.58
  Bottom 0.406: v100.58,34.67 100.58,16.87 88.16,4.45 v87.4,4.32 | v93.7,3.58 100.74,3.58 ISP.5
N$2  (via drill 0.6)
  Top 0.406: IC1.56 102,34.63 v101.8,34.75 | v101.58,23.98 99.8,23.98 v99.34,23.52 | v85.85,4.34 85.88,4.34 86.97,3.25 90.86,3.25 v92.46,1.88
  Bottom 0.406: v101.8,34.75 101.98,33.6 101.45,33.07 101.45,24.11 v101.58,23.98 | v99.34,23.52 99.34,16.74 88.09,5.49 87,5.49 v85.85,4.34 | ISP.1 106.2,3.96 106.2,1.75 105.74,1.29 93.04,1.29 v92.46,1.88
N$3
  Top 0.406: IC1.62 97.2,28.16 96.44,27.4 IC1.6 77.35,27.4 R22.2 | C32.2 77.27,29.82 R20.1 R22.2 | C12.1 77.3,27.66 R22.2
N$4  (via drill 0.6)
  Top 0.406: v106.83,34.82 105.97,34.07 IC1.51 | BAT1.1 50.35,5.32 v51.38,4.29
  Bottom 0.406: v106.83,34.82 106.38,34.42 106.4,21.54 87.48,2.62 53.06,2.62 v51.38,4.29
N$6
  Top 0.406: U2.6 22.55,14.02 22.1,14.48 22.1,18.85 C18.C
N$8
  Top 0.406: U2.2 25.2,8.94 25.65,9.4 27.94,9.4 28.45,8.89 28.45,4.32 27.94,3.81 25.35,3.81 C17.A
N$9
  Top 0.406: IC1.59 99.6,38.78 96.83,41.55 U$3.3
N$10
  Top 0.813: FER.1 14.07,22 C1.1 11.29,21.97 X1.VBUS
N$12
  Top 0.406: U3.16 14.22,31.74 9.14,26.67 X1.D-
N$13
  Top 0.406: U3.15 13.6,32.39 7.11,25.91 7.11,24.41 X1.D+
N$14
  Top 0.406: C7.1 93.42,48.74 95.12,47.04 95.12,46.43 U$4.19
N$15
  Top 0.406: U$4.16 88.77,46.3 88.92,46.46 88.92,47.6 C7.2
N$18
  Top 0.406: U3.17 14.58,31.09 11.79,28.3 C2.1
N$19
  Top 0.406: Q1.3 118.4,6.35 117.86,6.35 116.01,8.2 U$4.2
N$21
  Top 0.406: U$4.18 92.71,43.82 C8.1
N$22
  Top 0.406: U$4.17 90.17,43.77 C8.2
N$23
  Top 0.406: C9.1 85.09,48.64 U$4.15 85.09,43.87 R29.2
N$24
  Top 0.406: R15.1 46.2,30.08 C33.1 46.23,37.39 R31.2
N$25
  Top 0.406: Q1.1 118.3,4.94 117.78,5.46 116.51,5.46 R13.2 116.2,5.56 116.2,4.37 116.03,4.19 114.88,4.19 114.22,3.53 R14.2
N$32
  Top 0.406: C21.1 39.01,26.57 R10.1 38.96,24.28 38.96,23.16 38.51,22.71 34.75,22.71 34.31,23.14 SJ1.1
N$33  (via drill 0.6)
  Top 0.406: R10.2 35.87,24.63 SJ1.2 34.28,24.66 32.92,24.66 v32.33,24.33
  Bottom 0.406: MICROPHONE.2 36.03,24.83 35.41,25.45 33.4,25.43 v32.33,24.33
N$35
  Top 0.406: SJ3.2 24.48,48.74 LED5.C
N$36
  Top 0.406: TEMPERATURE.2 47.62,26.29 49.05,27.71 R15.2
N$37
  Top 0.813: R12.2 19.25,48.92 20.71,48.92 LED5.A
N$38  (via drill 0.6)
  Top 0.406: v56.39,22.1 56.39,22.86 57.4,23.88 58.62,23.88 R18.2
  Bottom 0.406: HUMIDITY.OUT 60.33,20.95 59.94,21.34 57.15,21.34 v56.39,22.1
N$39
  Top 0.406: U$4.1 120.32,8.2 R16.1
N$40  (via drill 0.6)
  Top 0.406: 69.24,29.74 C36.1 | 69.24,29.74 68.94,29.44 68.94,27.94 68.63,27.64 R21.2 | v66.73,34.54 68.38,34.54 68.81,34.11 68.81,30.18 69.24,29.74
  Bottom 0.406: PRESSURE.4 66.55,27.3 66.17,27.69 66.17,33.98 v66.73,34.54
N$41
  Top 0.406: U2.1 26.37,7.67 C28.A
N$42
  Top 0.406: U2.3 26.11,10.21 C28.C
N$43
  Top 0.406: U2.4 24.79,11.48 C29.A
N$47  (via drill 0.6)
  Top 0.406: R27.2 34.29,26.57 33.12,25.4 31.24,25.4 v30.33,24.49
  Bottom 0.406: v30.33,24.49 30.33,22.91 31.37,21.87 37.19,21.89 37.69,22.4 37.69,26.34 37.24,26.8 36.12,26.8 MICROPHONE.1
N$49
  Top 0.406: U2.5 24.94,12.75 25.53,13.31 25.53,14.99 C29.C
N$50
  Top 0.406: IC1.42 120.87,26.57 RTC_OSC1.P$2 122.68,25.25 arc90 123.04,24.89 123.04,25.04 124.36,25.04 arc90 C35.1 124.74,25.63
N$51
  Top 0.406: IC1.43 121.81,27.4 RTC_OSC1.P$1 124.18,27.48 arc90 C34.1
POWER  (via drill 0.6)
  Top 0.406: R2.1 R1.2 25.65,39.88 v26.42,40.64 | IC1.1 82.9,31.4 75.95,38.35 51.56,38.35 v50.8,39.12
  Bottom 0.406: v50.8,39.12 50.19,38.51 R2.1 26.42,40.03 v26.42,40.64
PRESSURE
  Top 0.406: R21.1 R26.1 70.23,25.48 70.23,24.38 70.97,23.65 77.47,23.65 78.02,24.2 IC1.10
RX_
  Top 0.406: U2.13 14.68,11.48 13.21,12.95 10.16,12.95 9.14,11.94 J2.2
SD_CD  (via drill 0.6)
  Top 0.406: IC1.26 102.8,17.2 102.89,17.2 102.89,18.72 103.43,19.25 107.72,19.25 v109.22,17.75 | 70.89,1.63 69.72,1.63 v68.89,4.24 | 70.89,1.63 v89.92,1.63 | R33.2 70.84,1.68 70.89,1.63 | U1.CD1 53.17,16.14 52.86,15.82 52.86,13.02 v55.8,10.08
  Bottom 0.406: v109.22,17.75 109.22,16.31 105.36,12.45 100.74,12.45 v89.92,1.63 | v55.8,10.08 60.34,5.54 67.59,5.54 v68.89,4.24
SD_CLK  (via drill 0.6)
  Top 0.406: IC1.23 100.4,12.26 93.95,5.89 72.49,5.89 v70.54,7.85 | v59.94,9.2 58.29,7.54 U1.5
  Bottom 0.406: v59.94,9.2 60.73,9.98 68.4,9.98 69.8,8.59 v70.54,7.85
SD_CS
  Top 0.406: IC1.20 98,12.88 96.22,11.1 64.21,11.1 61.62,8.51 61.62,6.27 U1.2
SD_MISO  (via drill 0.6)
  Top 0.406: IC1.22 99.6,12.33 93.65,6.5 73.66,6.5 v71.17,8.99 | U1.7 56.09,7.62 | 56.09,7.62 56.09,7.78 | v58.42,10.16 58.42,9.95 56.09,7.62
  Bottom 0.406: v58.42,10.16 58.9,10.64 68.86,10.64 70.51,8.99 v71.17,8.99
SD_MOSI
  Top 0.406: IC1.21 98.8,12.64 96.57,10.41 70.87,10.41 63.4,2.95 61.72,2.95 60.63,4.04 60.63,5.69 U1.3
SWITCH  (via drill 0.6)
  Top 0.406: IC1.48 111.08,31.4 v111.84,32.16 | 53.39,48.21 JP1.2 53.34,45.77 59.89,39.22 76.05,39.22 80.37,34.9 v81.56,34.9
  Bottom 0.406: U$5.2 59.44,44.58 59.08,44.22 54.63,44.22 53.39,45.47 53.39,48.21 JP1.2 | v111.84,32.16 111.84,33.91 110.11,35.69 82.42,35.69 v81.56,34.9
TEMP
  Top 0.406: IC1.2 82.53,30.6 75.41,37.72 48.67,37.72 R32.1 48.39,37.47 48.06,37.8 48.06,38.35 47.6,38.81 46.28,38.81 46.02,39.06 R31.1
TX_
  Top 0.406: U2.14 14.78,10.21 14.22,9.65 14.22,6.86 13.46,6.1 11.81,6.1 J2.5
V+  (via drill 0.6)
  Top 0.61: R16.2 123.7,8.23 v125.07,9.6 | v24.94,41.6 23.62,40.28 D2.1
  Top 0.813: D2.1 17.63,40.28 D1.1 17.53,40.39 16.26,40.39 15.85,40.8 C13.A 15.62,42.85 IC2.1
  Bottom 0.61: v125.07,9.6 125.07,42.16 118.34,48.9 84.68,48.9 78.21,42.42 25.76,42.42 v24.94,41.6
V_IN
  Top 0.406: D1.2 17.63,34.95 18.29,34.29 25.4,34.29 25.65,34.54 R1.1
  Top 0.813: J1.PWR D1.2
V_USB  (via drill 0.6)
  Top 0.813: v14.22,38.1 21.08,38.1 21.84,37.34 21.84,36.04 D2.2 | FER.2 14.07,29.06 v14.22,29.21
  Bottom 0.813: v14.22,29.21 v14.22,38.1
VCC  (via drill 0.6)
  Top 0.406: U2.16 21.31,7.67 | 21.31,7.67 C30.A | C25.1 27.73,29.46 29.77,29.46 R11.2 | 22.34,25.89 U3.4 | 22.34,25.89 22.1,25.65 22.1,21.85 C3.A 20.02,21.72 C4.1 20.57,20.91 20.57,13.97 21.31,13.24 21.31,7.67 | R12.1 28.17,45.75 29.46,44.45 29.46,33.58 | 29.46,33.58 v29.46,31.24 29.46,29.77 R11.2 | R11.2 R5.2 | 22.1,32.72 22.1,32.36 v22,32.26 | 22.1,32.72 22.91,33.53 29.41,33.53 29.46,33.58 | U3.20 18.88,29.14 v22,32.26 | U$4.22 102.87,48.76 C10.1 105.34,48.78 C11.A 105.39,46.32 U$4.23 105.49,46.22 105.49,40.87 | R4.2 118.58,48.78 119.3,48.06 119.3,44.37 119.79,43.89 120.73,43.89 R3.2 121.13,43.48 121.13,42.85 | R25.2 111.18,48.74 111.71,48.21 111.73,48.21 111.81,48.13 111.81,42.88 112.5,42.19 120.47,42.19 121.13,42.85 | 58.24,1.4 59.39,2.54 U1.4 59.31,7.04 60.83,8.56 60.83,9.91 57.63,13.11 57.61,13.11 57.1,13.61 57.1,18.49 v57.66,19.05 | U$3.4 100.45,41.55 C5.A 103.61,40.68 C15.1 105.39,40.77 105.49,40.87 | IC1.61 98,31.46 98.53,30.94 103.83,30.94 | 103.83,30.94 104.39,31.5 IC1.53 104.4,34.35 105.49,35.43 105.49,40.87 | IC1.45 105.77,29 103.83,30.94 | 102,20.29 IC1.25 102,7.68 C6.A | 102,20.29 102.71,21 103.07,21 103.19,21.12 | 102,20.29 101.91,20.2 IC1.15 90.7,20.2 C14.1 | R20.2 C32.1 C23.1 70.48,32.13 v70.48,34.98 | IC1.45 120.67,29 122.56,30.91 122.53,33.84 C16.1 124.76,39.22 121.13,42.85 | IC1.45 105.68,29 104.6,27.91 104.6,22.52 103.19,21.12 | C26.1 123.71,20.36 123.07,21 IC1.35 103.31,21 103.19,21.12 | C6.A 99.61,4.86 100.51,3.96 106.15,3.96 ISP.2 109.96,2.67 R17.2 112.11,2.79 C19.1 | 70.56,5.29 66.75,5.29 62.87,1.4 58.24,1.4 | 70.56,5.29 C6.A | 58.24,1.4 58.09,1.25 47.7,1.25 34.37,14.58 34.37,16.97 29.72,21.61 29.72,23.16 28.96,23.93 v28.96,24.49
  Top 0.406: 22.34,25.89 21.43,25.89 v20.17,27.15 | v22,32.26 22,32.61 22.1,32.72 | TEMPERATURE.1 46.23,25.27 C22.1 46.23,21.84 47.75,20.32 52.58,20.32 53.85,19.05 v57.66,19.05 | v57.66,19.05 58.67,20.06 C24.1 | R33.1 70.84,5.01 70.56,5.29
  Top 0.813: IC2.3 14.27,47.47 C27.A R12.1
  Bottom 0.406: 28.04,25.4 28.45,25.4 29.46,26.42 v29.46,31.24 29.49,31.22 32.44,31.22 32.51,31.14 | MICROPHONE.4 33.82,29.83 32.51,31.14 | 32.51,31.14 32.56,31.19 | v20.17,27.15 20.17,30.43 v22,32.26 | HUMIDITY.V+ 57.91,18.8 v57.66,19.05 57.66,16.43 59.03,15.06 65.66,15.06 66.37,15.77 66.37,24.54 66.6,24.77 PRESSURE.2 69.88,24.77 70.81,25.7 70.81,34.65 v70.48,34.98 | 28.04,25.4 v28.96,24.49 | 28.04,25.4 LIGHT.B2

### Text on the board
tValues: 5V-DC | FT232RL | RJ11
bValues: BUTTON
Document: BodyTrack Indoor Environmental Station V3 | Joshua Schapiro | June 2011 | + | +